# Altium schematic sheet [3]_USB_Interface.SchDoc: USB Interface
size A3; Author: Eladio Delgado Mingorance; CompanyName: Mareldem Technologies; Organization: Mareldem Technologies; Revision: 1.0A; SheetNumber: 3; SheetTotal: 5
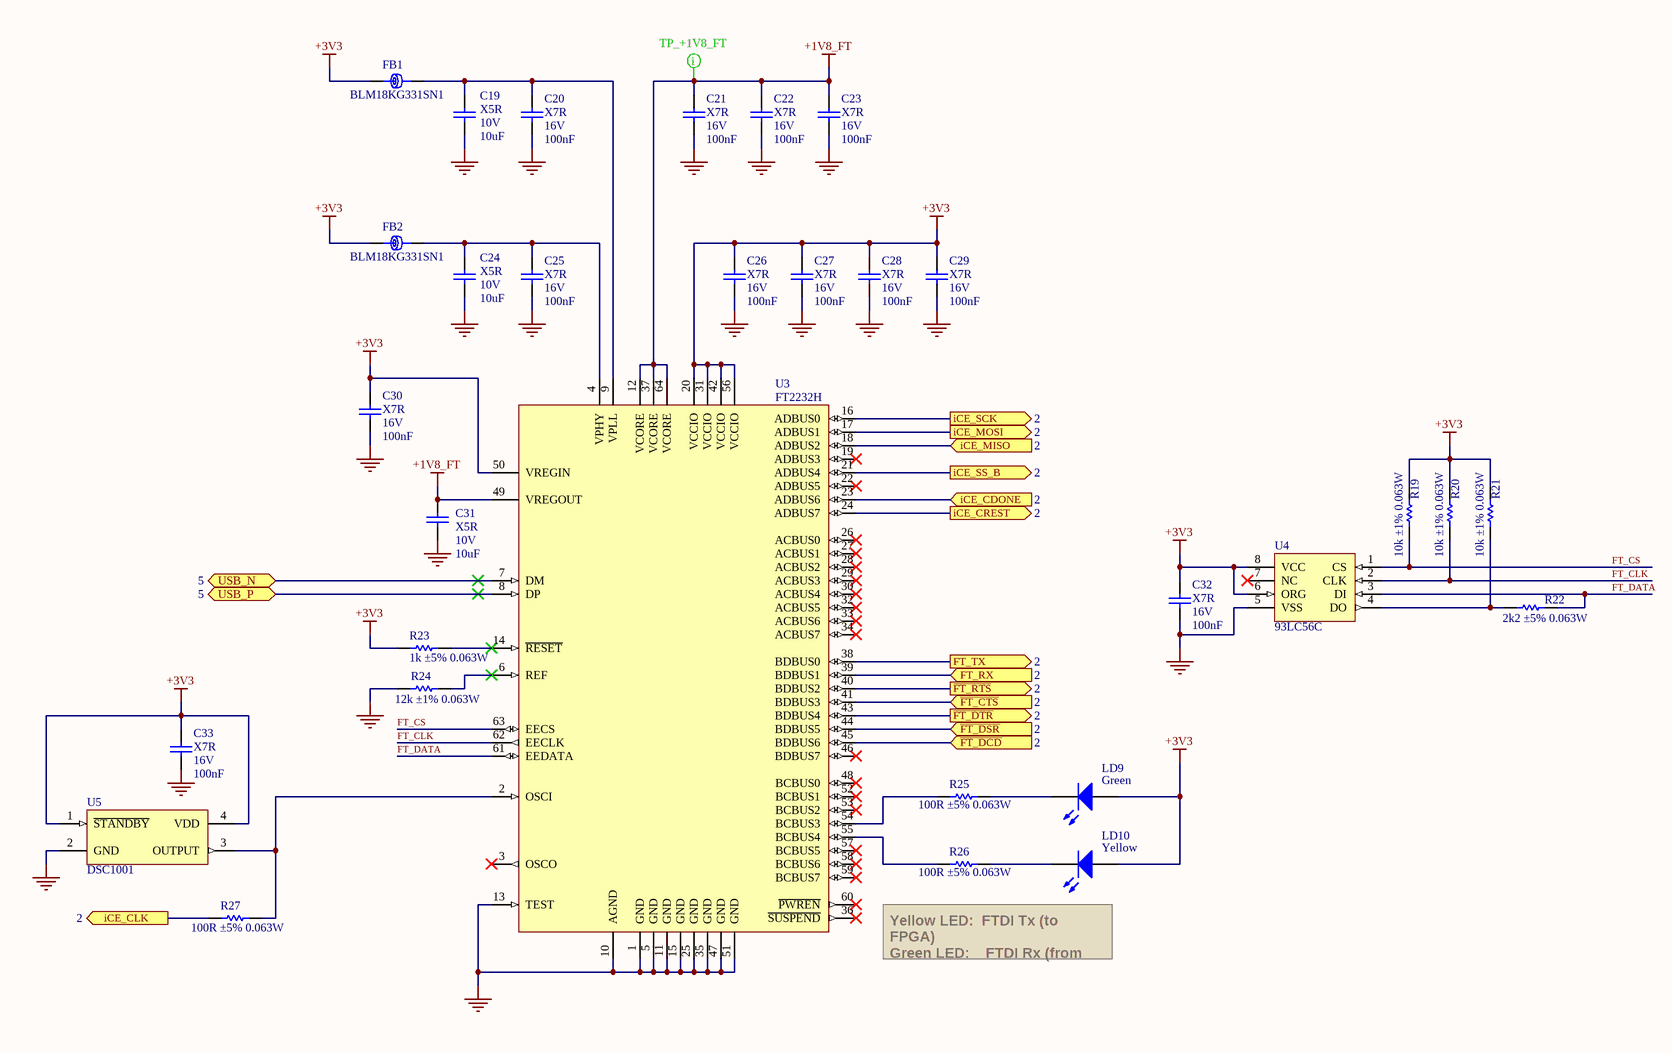
[diagram p0: [3]_USB_Interface.SchDoc]

## Parts
C19  Dielectric: X5R  Voltage: 10V  Capacitance: 10uF  [C0603]  (hidden comment: Capacitor)
C20  Dielectric: X7R  Voltage: 16V  Capacitance: 100nF  [C0402]  (hidden comment: Capacitor)
C21  Dielectric: X7R  Voltage: 16V  Capacitance: 100nF  [C0402]  (hidden comment: Capacitor)
C22  Dielectric: X7R  Voltage: 16V  Capacitance: 100nF  [C0402]  (hidden comment: Capacitor)
C23  Dielectric: X7R  Voltage: 16V  Capacitance: 100nF  [C0402]  (hidden comment: Capacitor)
C24  Dielectric: X5R  Voltage: 10V  Capacitance: 10uF  [C0603]  (hidden comment: Capacitor)
C25  Dielectric: X7R  Voltage: 16V  Capacitance: 100nF  [C0402]  (hidden comment: Capacitor)
C26  Dielectric: X7R  Voltage: 16V  Capacitance: 100nF  [C0402]  (hidden comment: Capacitor)
C27  Dielectric: X7R  Voltage: 16V  Capacitance: 100nF  [C0402]  (hidden comment: Capacitor)
C28  Dielectric: X7R  Voltage: 16V  Capacitance: 100nF  [C0402]  (hidden comment: Capacitor)
C29  Dielectric: X7R  Voltage: 16V  Capacitance: 100nF  [C0402]  (hidden comment: Capacitor)
C30  Dielectric: X7R  Voltage: 16V  Capacitance: 100nF  [C0402]  (hidden comment: Capacitor)
C31  Dielectric: X5R  Voltage: 10V  Capacitance: 10uF  [C0603]  (hidden comment: Capacitor)
C32  Dielectric: X7R  Voltage: 16V  Capacitance: 100nF  [C0402]  (hidden comment: Capacitor)
C33  Dielectric: X7R  Voltage: 16V  Capacitance: 100nF  [C0402]  (hidden comment: Capacitor)
FB1  BLM18KG331SN1  [L0603]
FB2  BLM18KG331SN1  [L0603]
LD9  Green  [LED0603]
LD10  Yellow  [LED0603]
R19  value 10k ±1% 0.063W  [R0402]  (hidden comment: Resistor)
R20  value 10k ±1% 0.063W  [R0402]  (hidden comment: Resistor)
R21  value 10k ±1% 0.063W  [R0402]  (hidden comment: Resistor)
R22  value 2k2 ±5% 0.063W  [R0402]  (hidden comment: Resistor)
R23  value 1k ±5% 0.063W  [R0402]  (hidden comment: Resistor)
R24  value 12k ±1% 0.063W  [R0402]  (hidden comment: Resistor)
R25  value 100R ±5% 0.063W  [R0402]  (hidden comment: Resistor)
R26  value 100R ±5% 0.063W  [R0402]  (hidden comment: Resistor)
R27  value 100R ±5% 0.063W  [R0402]  (hidden comment: Resistor)
U3  FT2232H  [FTDI_QFN-64]
U4  93LC56C  [MSOP8]
U5  DSC1001  [OSC 3.2x2.5]

## Ports
FT_RX (in, see 2), FT_TX (out, see 2), iCE_CDONE (in, see 2), iCE_CLK (out, see 2), iCE_CREST (out, see 2), iCE_MISO (in, see 2), iCE_MOSI (out, see 2), iCE_SCK (out, see 2), iCE_SS_B (out, see 2), USB_N (bidir, see 5), USB_P (bidir, see 5), ~{FT_CTS} (in, see 2), ~{FT_DCD} (in, see 2), ~{FT_DSR} (in, see 2), ~{FT_DTR} (out, see 2), ~{FT_RTS} (out, see 2)

## Nets
+1V8_FT: C21.2 C22.2 C23.2 C31.2 U3.12(VCORE) U3.37(VCORE) U3.49(VREGOUT) U3.64(VCORE)
+3V3: C26.2 C27.2 C28.2 C29.2 C30.2 C32.2 C33.2 FB1.1 FB2.1 LD9.A LD10.A R19.2 R20.2 R21.2 R23.2 U3.20(VCCIO) U3.31(VCCIO) U3.42(VCCIO) U3.50(VREGIN) U3.56(VCCIO) U4.6(ORG) U4.8(VCC) U5.1(~{STANDBY}) U5.4(VDD)
GND: C19.1 C20.1 C21.1 C22.1 C23.1 C24.1 C25.1 C26.1 C27.1 C28.1 C29.1 C30.1 C31.1 C32.1 C33.1 R24.2 U3.1(GND) U3.5(GND) U3.10(AGND) U3.11(GND) U3.13(TEST) U3.15(GND) U3.25(GND) U3.35(GND) U3.47(GND) U3.51(GND) U4.5(VSS) U5.2(GND)
~{FT_CTS}: U3.41(BDBUS3) ; port ~{FT_CTS}
~{FT_DCD}: U3.45(BDBUS6) ; port ~{FT_DCD}
~{FT_DSR}: U3.44(BDBUS5) ; port ~{FT_DSR}
~{FT_DTR}: U3.43(BDBUS4) ; port ~{FT_DTR}
~{FT_RTS}: U3.40(BDBUS2) ; port ~{FT_RTS}
FT_CLK: R20.1 U3.62(EECLK) U4.2(CLK)
FT_CS: R19.1 U3.63(EECS) U4.1(CS)
FT_DATA: R22.1 U3.61(EEDATA) U4.3(DI)
FT_RX: U3.39(BDBUS1) ; port FT_RX
FT_TX: U3.38(BDBUS0) ; port FT_TX
iCE_CDONE: U3.23(ADBUS6) ; port iCE_CDONE
iCE_CLK: R27.2 ; port iCE_CLK
iCE_CREST: U3.24(ADBUS7) ; port iCE_CREST
iCE_MISO: U3.18(ADBUS2) ; port iCE_MISO
iCE_MOSI: U3.17(ADBUS1) ; port iCE_MOSI
iCE_SCK: U3.16(ADBUS0) ; port iCE_SCK
iCE_SS_B: U3.21(ADBUS4) ; port iCE_SS_B
USB_N: U3.7(DM) ; port USB_N
USB_P: U3.8(DP) ; port USB_P
NetC19_2: C19.2 C20.2 FB1.2 U3.9(VPLL)
NetC24_2: C24.2 C25.2 FB2.2 U3.4(VPHY)
NetLD9_K: LD9.K R25.2
NetLD10_K: LD10.K R26.2
NetR21_1: R21.1 R22.2 U4.4(DO)
NetR23_1: R23.1 U3.14(~{RESET})
NetR24_1: R24.1 U3.6(REF)
NetR25_1: R25.1 U3.54(BCBUS3)
NetR26_1: R26.1 U3.55(BCBUS4)
NetR27_1: R27.1 U3.2(OSCI) U5.3(OUTPUT)

Not connected (* = marked no-connect by the designer): U3 3(OSCO)* 19(ADBUS3)* 22(ADBUS5)* 26(ACBUS0)* 27(ACBUS1)* 28(ACBUS2)* 29(ACBUS3)* 30(ACBUS4)* 32(ACBUS5)* 33(ACBUS6)* 34(ACBUS7)* 36(~{SUSPEND})* 46(BDBUS7)* 48(BCBUS0)* 52(BCBUS1)* 53(BCBUS2)* 57(BCBUS5)* 58(BCBUS6)* 59(BCBUS7)* 60(~{PWREN})*; U4 7(NC)*

## Layout directives
net class Test Points: +1V8_FT

## Notes on the sheet
- Yellow LED:  FTDI Tx (to FPGA)
  Green LED:    FTDI Rx (from FPGA)
- Alhambra II
- Open FPGA Board
- Project
- Sheet
- Author:
- Version:
- /
- A3
- Date:
- Time:
- Variation:

## Library data of the parts
C19 C24 C31 = C0603_10uF_10V_±10%: Capacitor SMD; Manufacturer: Murata; Value: 10uF ±10% 10V; Tolerance: ±10%; OrderingCode: GRM188R61A106KE69D; Temp_ Max: 85; Temp_ Min: -55; Part Number: C0603_10uF_10V_±10%; Price (€): 0,027
C20-C23 C25-C30 C32 C33 = C0402_100nF_16V_±10%: Capacitor SMD; Manufacturer: Kemet; Value: 100nF ±10% 16V; Tolerance: ±10%; OrderingCode: C0402C104K4RAC; Temp_ Max: 125; Temp_ Min: -55; Part Number: C0402_100nF_16V_±10%; Price (€): 0,05
FB1 FB2 = L0603_330R_0,080R_1700 mA: Ferrite Bead; Manufacturer: Murata; Resistance_100MHz: 330R; Resistance_DC: 0,080R; Current: 1700 mA; Temp_ Max: 125; Temp_ Min: -55; Value: 330R 0,080R 1700 mA; Part Number: L0603_330R_0,080R_1700 mA; OrderingCode: BLM18KG331SN1; Price (€): 0,021
LD9 = LED Green 0603 Wurth: LED; Manufacturer: WE; OrderingCode: 150 060 VS7 5000; Temp_ Max: 85; Temp_ Min: -40; Part Number: LED Green 0603 Wurth; Price (€): 0,07; Value: Green
LD10 = LED Yellow 0603 Wurth: LED; Manufacturer: WE; OrderingCode: 150 060 YS7 5000; Temp_ Max: 85; Temp_ Min: -40; Part Number: LED Yellow 0603 Wurth; Price (€): 0,07; Value: Yellow
R19-R21 = R0402_10k_0.063W_±1%: Resistor, SMD; Manufacturer: Vishay; Tolerance: ±1%; OrderingCode: CRCW040210K0FK; Power: 0.063W; Resistance: 10k; Temp_ Max: 155; Temp_ Min: -55; PackageDescription: SMD; Part Number: R0402_10k_0.063W_±1%; Price (€): 0,006
R22 = R0402_2k2_0.063W_±5%: Resistor, SMD; Manufacturer: Vishay; Tolerance: ±5%; OrderingCode: CRCW04022K20JN; Power: 0.063W; Resistance: 2k2; Temp_ Max: 155; Temp_ Min: -55; PackageDescription: SMD; Part Number: R0402_2k2_0.063W_±5%; Price (€): 0,003
R23 = R0402_1k_0.063W_±5%: Resistor, SMD; Manufacturer: Vishay; Tolerance: ±5%; OrderingCode: CRCW04021K00JN; Power: 0.063W; Resistance: 1k; Temp_ Max: 155; Temp_ Min: -55; PackageDescription: SMD; Part Number: R0402_1k_0.063W_±5%; Price (€): 0,003
R24 = R0402_12k_0.063W_±1%: Resistor, SMD; Manufacturer: Vishay; Tolerance: ±1%; OrderingCode: CRCW040212K0FK; Power: 0.063W; Resistance: 12k; Temp_ Max: 155; Temp_ Min: -55; PackageDescription: SMD; Part Number: R0402_12k_0.063W_±1%; Price (€): 0,006
R25-R27 = R0402_100R_0.063W_±5%: Resistor, SMD; Manufacturer: Vishay; Tolerance: ±5%; OrderingCode: CRCW0402100RJN; Power: 0.063W; Resistance: 100R; Temp_ Max: 155; Temp_ Min: -55; PackageDescription: SMD; Part Number: R0402_100R_0.063W_±5%; Price (€): 0,003
U3 = FT2232H: Dual High Speed USB to Multipurpose UART/FIFO IC; Manufacturer: FTDI; OrderingCode: FT2232HQ-REEL; Temp_ Max: 85; Temp_ Min: -40; Part Number: FT2232H; Supplier: Silica; Price (€): 3,45
U4 = 93LC56C: EEPROM, 2K Microwire Compatible Serial, 8 or 16 bit word size, 2.5-5.5 Vcc range; Manufacturer: Microchip; OrderingCode: 93LC56CT-I/MS; Temp_ Max: 85; Temp_ Min: -40; Value: 2Kb; Part Number: 93LC56C; Supplier: Silica; Price (€): 0,24
U5 = DSC1001-12MHZ: Oscillator, Low-Power CMOS, 4 pin, 1.8-3.3V; Manufacturer: Microchip; OrderingCode: DSC1001CL2-012.0000; Temp_ Max: 105; Temp_ Min: -40; Value: 12MHz; Part Number: DSC1001-12MHZ; Price (€): 0,61